# EAGLE design 130609_ReceiverSTM_0_0 (EAGLE 6.1)
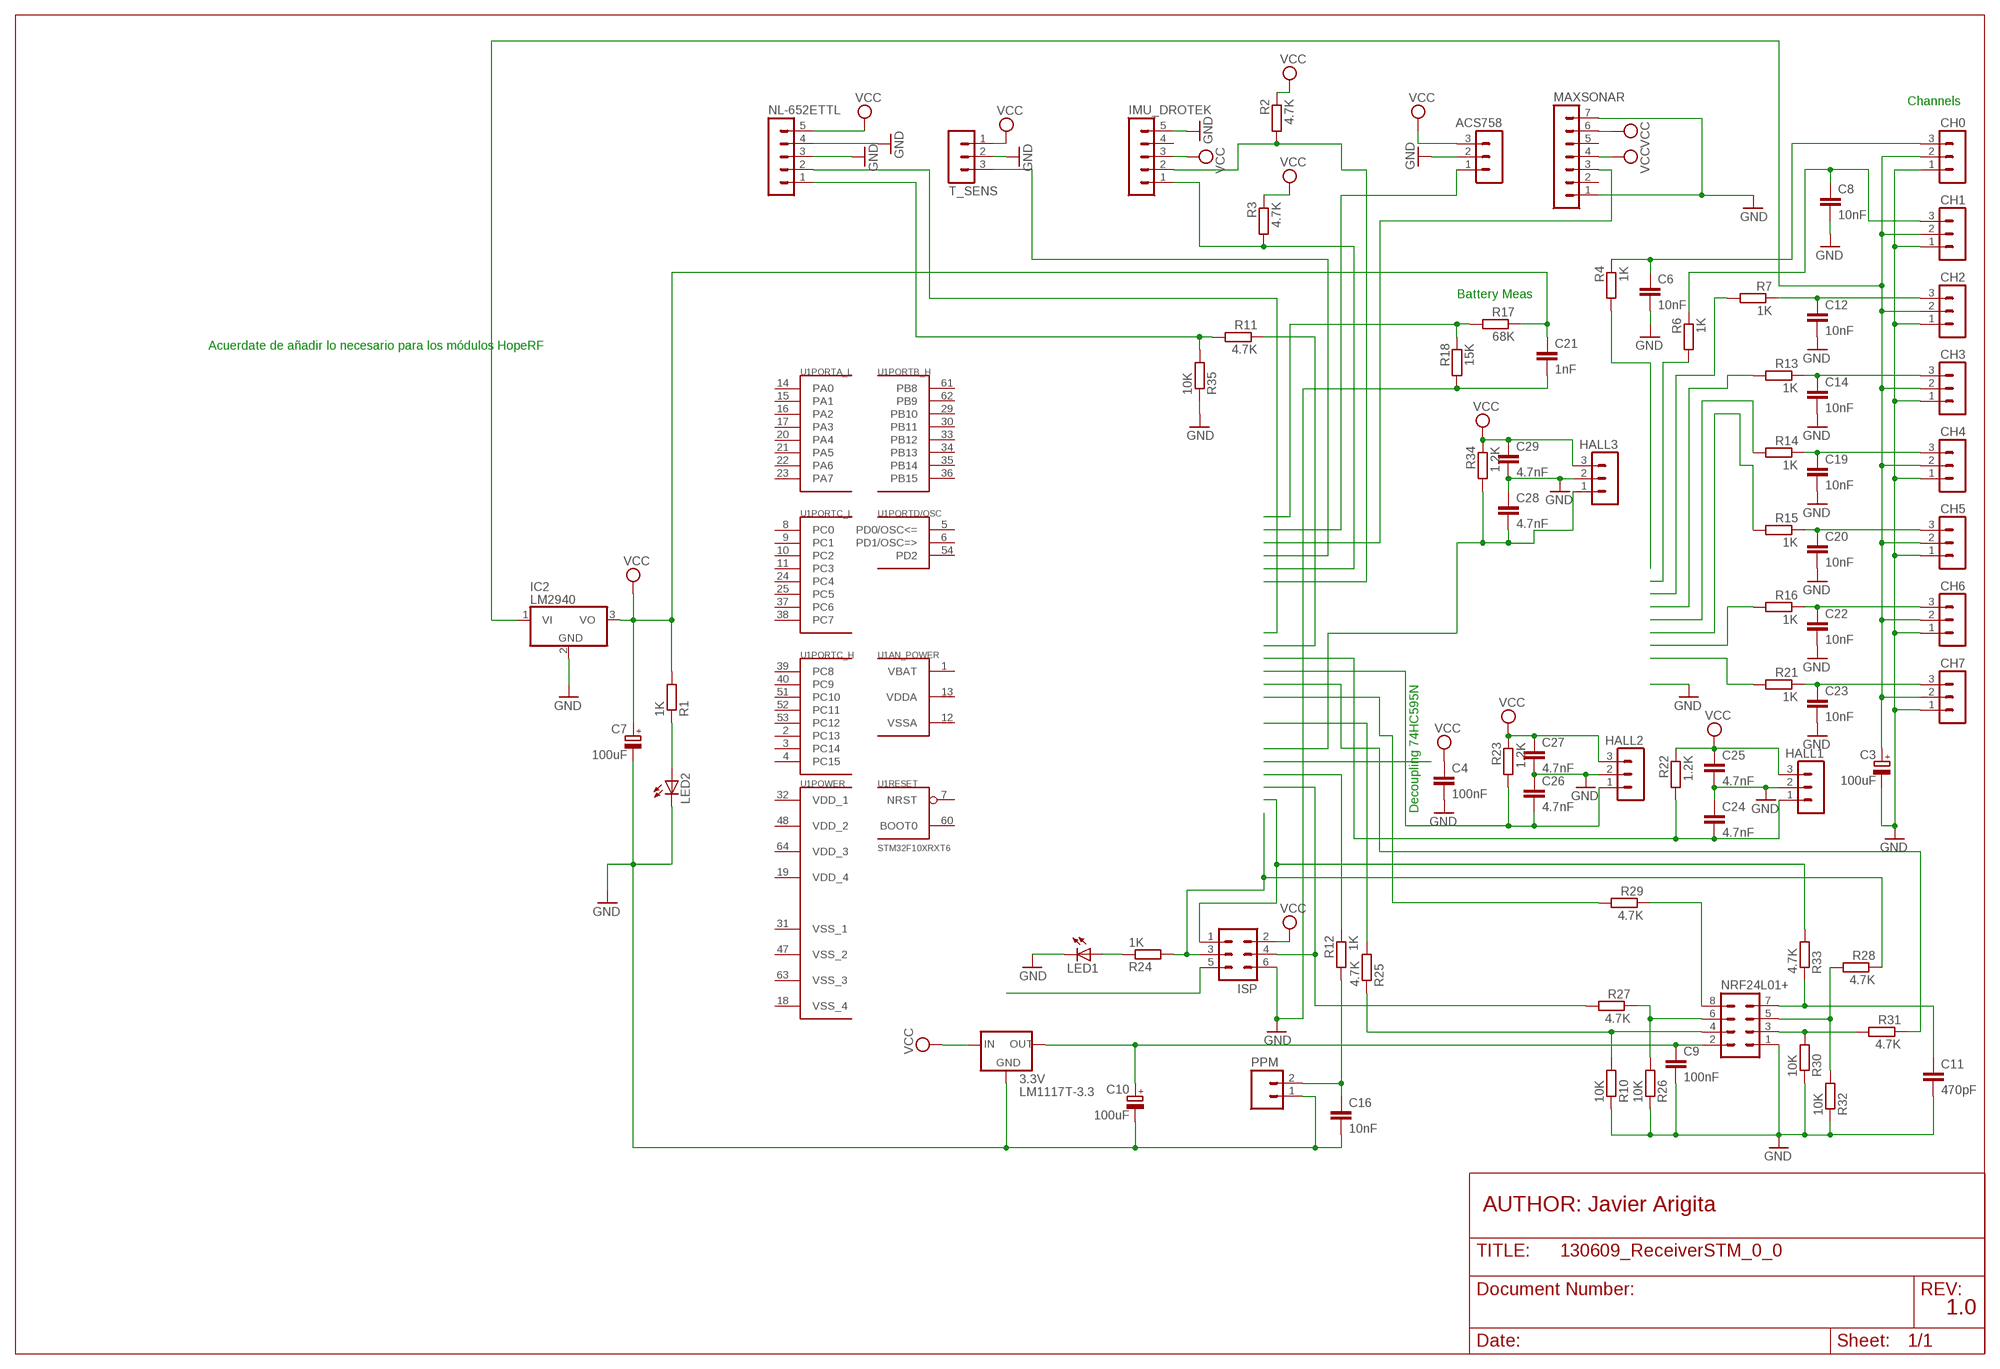
[diagram p0: schematic, sheet 1]

## Parts
3.3V  LM1117T-3.3  [TO220]
ACS758  MA03-1  [MA03-1]
C3  100uF  CPOL-EUE2,5-6E  [E2,5-6E]
C4  100nF  C-EU050-025X075  [C050-025X075]
C6  10nF  C-EU025-030X050  [C025-030X050]
C7  100uF  CPOL-EUE2,5-6E  [E2,5-6E]
C8  10nF  C-EU025-030X050  [C025-030X050]
C9  100nF  C-EU050-025X075  [C050-025X075]
C10  100uF  CPOL-EUE2,5-6E  [E2,5-6E]
C11  470pF  C-EU025-030X050  [C025-030X050]
C12  10nF  C-EU025-030X050  [C025-030X050]
C14  10nF  C-EU025-030X050  [C025-030X050]
C16  10nF  C-EU025-030X050  [C025-030X050]
C19  10nF  C-EU025-030X050  [C025-030X050]
C20  10nF  C-EU025-030X050  [C025-030X050]
C21  1nF  C-EU050-025X075  [C050-025X075]
C22  10nF  C-EU025-030X050  [C025-030X050]
C23  10nF  C-EU025-030X050  [C025-030X050]
C24  4.7nF  C-EU025-030X050  [C025-030X050]
C25  4.7nF  C-EU025-030X050  [C025-030X050]
C26  4.7nF  C-EU025-030X050  [C025-030X050]
C27  4.7nF  C-EU025-030X050  [C025-030X050]
C28  4.7nF  C-EU025-030X050  [C025-030X050]
C29  4.7nF  C-EU025-030X050  [C025-030X050]
CH0  MA03-1  [MA03-1]
CH1  MA03-1  [MA03-1]
CH2  MA03-1  [MA03-1]
CH3  MA03-1  [MA03-1]
CH4  MA03-1  [MA03-1]
CH5  MA03-1  [MA03-1]
CH6  MA03-1  [MA03-1]
CH7  MA03-1  [MA03-1]
HALL1  MA03-1  [MA03-1]
HALL2  MA03-1  [MA03-1]
HALL3  MA03-1  [MA03-1]
IC2  LM2940  [TO220V]
IMU_DROTEK  MA05-1  [MA05-1]
ISP  MA03-2  [MA03-2]
LED1  LED5MM  [LED5MM]
LED2  LED5MM  [LED5MM]
MAXSONAR  MA07-1  [MA07-1]
NL-652ETTL  MA05-1  [MA05-1]
NRF24L01+  MA04-2  [MA04-2]
PPM  M02  [02P]
R1  1K  R-EU_0204/7  [0204/7]
R2  4.7K  R-EU_0204/7  [0204/7]
R3  4.7K  R-EU_0204/7  [0204/7]
R4  1K  R-EU_0204/7  [0204/7]
R6  1K  R-EU_0204/7  [0204/7]
R7  1K  R-EU_0204/7  [0204/7]
R10  10K  R-EU_0204/7  [0204/7]
R11  4.7K  R-EU_0204/7  [0204/7]
R12  1K  R-EU_0204/7  [0204/7]
R13  1K  R-EU_0204/7  [0204/7]
R14  1K  R-EU_0204/7  [0204/7]
R15  1K  R-EU_0204/7  [0204/7]
R16  1K  R-EU_0204/7  [0204/7]
R17  68K  R-EU_0204/7  [0204/7]
R18  15K  R-EU_0204/7  [0204/7]
R21  1K  R-EU_0204/7  [0204/7]
R22  1.2K  R-EU_0204/7  [0204/7]
R23  1.2K  R-EU_0204/7  [0204/7]
R24  1K  R-EU_0204/7  [0204/7]
R25  4.7K  R-EU_0204/7  [0204/7]
R26  10K  R-EU_0204/7  [0204/7]
R27  4.7K  R-EU_0204/7  [0204/7]
R28  4.7K  R-EU_0204/7  [0204/7]
R29  4.7K  R-EU_0204/7  [0204/7]
R30  10K  R-EU_0204/7  [0204/7]
R31  4.7K  R-EU_0204/7  [0204/7]
R32  10K  R-EU_0204/7  [0204/7]
R33  4.7K  R-EU_0204/7  [0204/7]
R34  1.2K  R-EU_0204/7  [0204/7]
R35  10K  R-EU_0204/7  [0204/7]
T_SENS  MA03-1  [MA03-1]
U1  STM32F10XRXT6  [TQFP64]

## Nets
GND: 3.3V.1(GND) ACS758.2 C3.- C4.2 C6.2 C7.- C8.2 C9.2 C10.- C11.2 C12.2 C14.2 C16.2 C19.2 C20.2 C21.2 C22.2 C23.2 C24.1 C25.2 C26.1 C27.2 C28.1 C29.2 CH0.1 CH1.1 CH2.1 CH3.1 CH4.1 CH5.1 CH6.1 CH7.1 HALL1.2 HALL2.2 HALL3.2 IC2.2(GND) IMU_DROTEK.5 ISP.6 LED1.K(C) LED2.K(C) MAXSONAR.1 MAXSONAR.7 NL-652ETTL.3 NL-652ETTL.4 NRF24L01+.1 PPM.1 R10.1 R18.2 R26.1 R30.1 R32.1 R35.1 T_SENS.2
MAX_BRIDGE: NL-652ETTL.2
N$3: ISP.5
N$6: 3.3V.3(IN) ACS758.3 C4.1 C7.+ C21.1 C25.1 C27.1 C29.1 HALL1.3 HALL2.3 HALL3.3 IC2.3(VO) IMU_DROTEK.3 ISP.2 MAXSONAR.4 MAXSONAR.6 NL-652ETTL.5 R1.2 R2.1 R3.1 R17.1 R22.1 R23.1 R34.1 T_SENS.1 ; supply symbol labelled VCC
N$7: LED2.A R1.1
N$8: IMU_DROTEK.2 R2.2
N$11: C28.2 HALL3.1 R34.2
N$12: R11.1
N$14: C24.2 HALL1.1 R22.2
N$15: R12.1
N$17: 3.3V.2(OUT) C9.1 C10.+ NRF24L01+.2
N$18: NRF24L01+.4 R10.2 R25.1
N$19: NRF24L01+.3 R30.2 R31.2
N$20: C16.1 PPM.2 R12.2
N$22: NL-652ETTL.1 R11.2 R35.2
N$25: T_SENS.3
N$26: R25.2
N$27: IMU_DROTEK.1 R3.2
N$28: ACS758.1
N$29: MAXSONAR.3
N$30: C26.2 HALL2.1 R23.2
N$33: R17.2 R18.1
N$35: C3.+ CH0.2 CH1.2 CH2.2 CH3.2 CH4.2 CH5.2 CH6.2 CH7.2 IC2.1(VI)
N$37: ISP.3 R24.2 R28.1
N$38: LED1.A R24.1
N$40: ISP.1 R33.2
N$41: ISP.4 R27.2
N$42: NRF24L01+.8 R29.1
N$43: NRF24L01+.6 R26.2 R27.1
N$46: R31.1
N$47: NRF24L01+.5 R28.2 R32.2
N$49: C11.1 NRF24L01+.7 R33.1
N$50: C6.1 CH0.3 R4.1
N$51: R4.2
N$52: R6.2
N$53: C8.1 CH1.3 R6.1
N$54: C12.1 CH2.3 R7.1
N$55: R7.2
N$56: C14.1 CH3.3 R13.1
N$57: R13.2
N$58: C19.1 CH4.3 R14.1
N$59: R14.2
N$60: C20.1 CH5.3 R15.1
N$61: R15.2
N$62: C22.1 CH6.3 R16.1
N$63: R16.2
N$64: C23.1 CH7.3 R21.1
N$65: R21.2
N$66: R29.2
Unconnected: IMU_DROTEK.4 MAXSONAR.2 MAXSONAR.5 U1.2(PORTC_H:PC13) U1.3(PORTC_H:PC14) U1.4(PORTC_H:PC15) U1.5(PORTD/OSC:PD0/OSC<=) U1.6(PORTD/OSC:PD1/OSC=>) U1.7(RESET:NRST) U1.8(PORTC_L:PC0) U1.9(PORTC_L:PC1) U1.10(PORTC_L:PC2) U1.11(PORTC_L:PC3) U1.14(PORTA_L:PA0) U1.15(PORTA_L:PA1) U1.16(PORTA_L:PA2) U1.17(PORTA_L:PA3) U1.20(PORTA_L:PA4) U1.21(PORTA_L:PA5) U1.22(PORTA_L:PA6) U1.23(PORTA_L:PA7) U1.24(PORTC_L:PC4) U1.25(PORTC_L:PC5) U1.26(PORTB_L:PB0) U1.27(PORTB_L:PB1) U1.28(PORTB_L:PB2) U1.29(PORTB_H:PB10) U1.30(PORTB_H:PB11) U1.33(PORTB_H:PB12) U1.34(PORTB_H:PB13) U1.35(PORTB_H:PB14) U1.36(PORTB_H:PB15) U1.37(PORTC_L:PC6) U1.38(PORTC_L:PC7) U1.39(PORTC_H:PC8) U1.40(PORTC_H:PC9) U1.41(PORTA_H:PA8) U1.42(PORTA_H:PA9) U1.43(PORTA_H:PA10) U1.44(PORTA_H:PA11) U1.45(PORTA_H:PA12) U1.46(PORTA_H:PA13) U1.49(PORTA_H:PA14) U1.50(PORTA_H:PA15) U1.51(PORTC_H:PC10) U1.52(PORTC_H:PC11) U1.53(PORTC_H:PC12) U1.54(PORTD/OSC:PD2) U1.55(PORTB_L:PB3) U1.56(PORTB_L:PB4) U1.57(PORTB_L:PB5) U1.58(PORTB_L:PB6) U1.59(PORTB_L:PB7) U1.60(RESET:BOOT0) U1.61(PORTB_H:PB8) U1.62(PORTB_H:PB9)

## Notes on the sheet
- Channels
- Battery Meas
- Acuerdate de añadir lo necesario para los módulos HopeRF
- Decoupling 74HC595N
- AUTHOR: Javier Arigita
- 1.0

## Power pins joined to a net without a drawn wire
VBAT: U1.1(AN_POWER:VBAT)
VDD_1: U1.32(POWER:VDD_1)
VDD_2: U1.48(POWER:VDD_2)
VDD_3: U1.64(POWER:VDD_3)
VDD_4: U1.19(POWER:VDD_4)
VDDA: U1.13(AN_POWER:VDDA)
VSS_1: U1.31(POWER:VSS_1)
VSS_2: U1.47(POWER:VSS_2)
VSS_3: U1.63(POWER:VSS_3)
VSS_4: U1.18(POWER:VSS_4)
VSSA: U1.12(AN_POWER:VSSA)

## Library data of the parts
3.3V = lm1117:LM1117T-*
ACS758 CH0 CH1-CH7 HALL1-HALL3 T_SENS = con-lstb:MA03-1: PIN HEADER; OC_FARNELL: unknown; OC_NEWARK: unknown
C3 C7 C10 = rcl:CPOL-EU: POLARIZED CAPACITOR, European symbol
C4 C6 C8 C9 C11 C12 C14 C16 C19-C29 = rcl:C-EU: CAPACITOR, European symbol
IC2 = lm2940:LM2940: LM2940-5 1A Voltage Regulators
IMU_DROTEK NL-652ETTL = con-lstb:MA05-1: PIN HEADER; OC_FARNELL: unknown; OC_NEWARK: unknown
ISP = con-lstb:MA03-2: PIN HEADER; OC_FARNELL: unknown; OC_NEWARK: unknown
LED1 LED2 = led:LED: LED OSRAM: - CHIPLED LG R971, LG N971, LY N971, LG Q971, LY Q971, LO R971, LY R971 LH N974, LH R974 LS Q976, LO Q976, LY Q976 LO Q996 - Hyper CHIPLED LW Q18S LB Q993, LB Q99A, LB R99A - SideLED LS A670, LO A670, LY A670, LG A670, LP A670 LB A673, LV A673, LT A673, LW A673 LH A674 LY A675 LS A676, LA A676, LO A676, LY A676, LW A676 LS A679, LY A679, LG A679 - Hyper Micro SIDELED® LS Y876, LA Y876, LO Y876, LY Y876 LT Y87S - SmartLED LW L88C, LW L88S LB L89C, LB L89S, LG L890 LS L89K, LO L89K, LY L89K LS L896, LA L896, LO L896, LY L896 - TOPLED LS T670, LO T670, LY T670, LG T670, LP T670 LSG T670, LSP T670, LSY T670, LOP T670, LYG T670 LG T671, LOG T671, LSG T671 LB T673, LV T673, LT T673, LW T673 LH T674 LS T676, LA T676, LO T676, LY T676, LB T676, LH T676, LSB T676, LW T676 LB T67C, LV T67C, LT T67C, LS T67K, LO T67K, LY T67K, LW E67C LS E67B, LA E67B, LO E67B, LY E67B, LB E67C, LV E67C, LT E67C LW T67C LS T679, LY T679, LG T679 LS T770, LO T770, LY T770, LG T770, LP T770 LB T773, LV T773, LT T773, LW T773 LH T774 LS E675, LA E675, LY E675, LS T675 LS T776, LA T776, LO T776, LY T776, LB T776 LHGB T686 LT T68C, LB T68C - Hyper Mini TOPLED® LB M676 - Mini TOPLED Santana® LG M470 LS M47K, LO M47K, LY M47K Source: http://www.osram.convergy.de LUXEON: - LUMILED® LXK2-PW12-R00, LXK2-PW12-S00, LXK2-PW14-U00, LXK2-PW14-V00 LXK2-PM12-R00, LXK2-PM12-S00, LXK2-PM14-U00 LXK2-PE12-Q00, LXK2-PE12-R00, LXK2-PE12-S00, LXK2-PE14-T00, LXK2-PE14-U00 LXK2-PB12-K00, LXK2-PB12-L00, LXK2-PB12-M00, LXK2-PB14-N00, LXK2-PB14-P00, LXK2-PB14-Q00 LXK2-PR12-L00, LXK2-PR12-M00, LXK2-PR14-Q00, LXK2-PR14-R00 LXK2-PD12-Q00, LXK2-PD12-R00, LXK2-PD12-S00 LXK2-PH12-R00, LXK2-PH12-S00 LXK2-PL12-P00, LXK2-PL12-Q00, LXK2-PL12-R00 Source: www.luxeon.com KINGBRIGHT: KA-3528ASYC Source: www.kingbright.com
MAXSONAR = con-lstb:MA07-1: PIN HEADER; OC_FARNELL: unknown; OC_NEWARK: unknown
NRF24L01+ = con-lstb:MA04-2: PIN HEADER; OC_FARNELL: unknown; OC_NEWARK: unknown
PPM = con-amp-quick:M02: AMP QUICK CONNECTOR; OC_FARNELL: unknown; OC_NEWARK: unknown
R1-R4 R6 R7 R10-R18 R21-R35 = rcl:R-EU_: RESISTOR, European symbol
U1 = stm32:STM32F10XRXT6: STM32F101/103 64pin LQFP

## Board
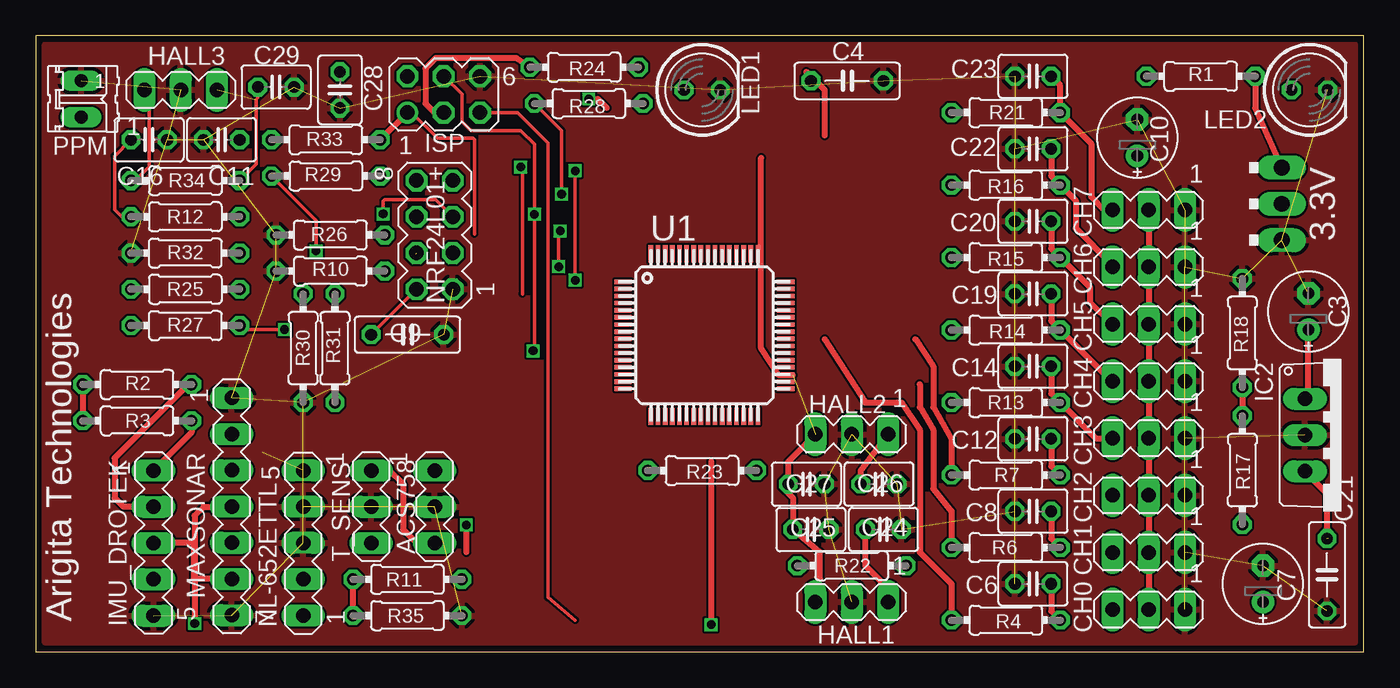
[diagram p1: board, top side]
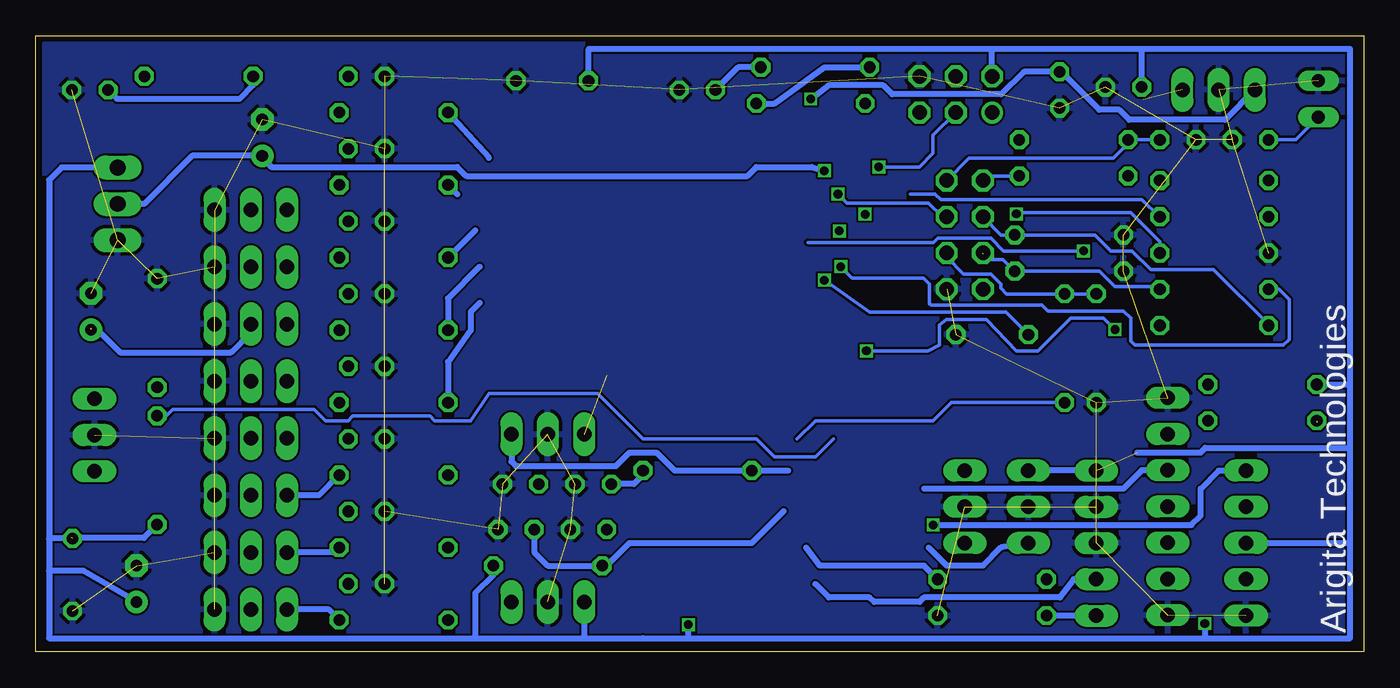
[diagram p2: board, bottom side, seen from below]

Size 93.02 x 43.17 mm. Coordinates in mm from the lower left corner, seen from the top.
Outline: 0,0 93.02,0 93.02,43.17 0,43.17 0,0
Copper layers (1*16): Top 0.035mm / dielectric 1.5mm / Bottom 0.035mm
Design rules: minimum track width 6mil, minimum drill 12mil, track to track 6mil, track to pad 6mil, pad to pad 6mil, via to via 6mil, smd to smd 0mil, copper to edge 10mil, drill to drill 10mil, minimum pad ring 10mil, minimum via ring 6mil, stop-mask expansion 2mil, vias tented up to drill 100mil, thermal gap 10mil

### Footprints (pad centres in the part's own frame; a part is rotated, then mirrored left to right if it is on the bottom)
TO220 = drill 1.118 long: 1 -2.54,-6.35; 2 0,-6.35; 3 2.54,-6.35
MA03-1 = drill 1.016 long: 1 -2.54,0; 2 0,0; 3 2.54,0
E2,5-6E = drill 0.813 pad 1.575: + -1.27,0 | drill 0.813 pad 1.575 octagon: - 1.27,0
C050-025X075 = drill 0.813 octagon: 1 -2.54,0; 2 2.54,0
C025-030X050 = drill 0.813 octagon: 1 -1.27,0; 2 1.27,0
TO220V = drill 1.016 long: 1 -2.54,-2.54; 2 0,-2.54; 3 2.54,-2.54
MA05-1 = drill 1.016 long: 1 -5.08,0; 2 -2.54,0; 3 0,0; 4 2.54,0; 5 5.08,0
MA03-2 = drill 1.016: 1 -2.54,-1.27 | drill 1.016 octagon: 2 -2.54,1.27; 3 0,-1.27; 4 0,1.27; 5 2.54,-1.27; 6 2.54,1.27
LED5MM = drill 0.813 octagon: A -1.27,0; K 1.27,0
MA07-1 = drill 1.016 long: 1 -7.62,0; 2 -5.08,0; 3 -2.54,0; 4 0,0; 5 2.54,0; 6 5.08,0; 7 7.62,0
MA04-2 = drill 1.016 octagon: 1 -3.81,-1.27; 2 -3.81,1.27; 3 -1.27,-1.27; 4 -1.27,1.27; 5 1.27,-1.27; 6 1.27,1.27; 7 3.81,-1.27; 8 3.81,1.27
02P = drill 0.914 long: 1 -1.27,0; 2 1.27,0
0204/7 = drill 0.813 octagon: 1 -3.81,0; 2 3.81,0
TQFP64 = smd 1.2 x 0.3: 1 -5.7,3.75; 2 -5.7,3.25; 3 -5.7,2.75; 4 -5.7,2.25; 5 -5.7,1.75; 6 -5.7,1.25; 7 -5.7,0.75; 8 -5.7,0.25; 9 -5.7,-0.25; 10 -5.7,-0.75; 11 -5.7,-1.25; 12 -5.7,-1.75; 13 -5.7,-2.25; 14 -5.7,-2.75; 15 -5.7,-3.25; 16 -5.7,-3.75; 33 5.7,-3.75; 34 5.7,-3.25; 35 5.7,-2.75; 36 5.7,-2.25; 37 5.7,-1.75; 38 5.7,-1.25; 39 5.7,-0.75; 40 5.7,-0.25; 41 5.7,0.25; 42 5.7,0.75; 43 5.7,1.25; 44 5.7,1.75; 45 5.7,2.25; 46 5.7,2.75; 47 5.7,3.25; 48 5.7,3.75 | smd 0.3 x 1.2: 17 -3.75,-5.7; 18 -3.25,-5.7; 19 -2.75,-5.7; 20 -2.25,-5.7; 21 -1.75,-5.7; 22 -1.25,-5.7; 23 -0.75,-5.7; 24 -0.25,-5.7; 25 0.25,-5.7; 26 0.75,-5.7; 27 1.25,-5.7; 28 1.75,-5.7; 29 2.25,-5.7; 30 2.75,-5.7; 31 3.25,-5.7; 32 3.75,-5.7; 49 3.75,5.7; 50 3.25,5.7; 51 2.75,5.7; 52 2.25,5.7; 53 1.75,5.7; 54 1.25,5.7; 55 0.75,5.7; 56 0.25,5.7; 57 -0.25,5.7; 58 -0.75,5.7; 59 -1.25,5.7; 60 -1.75,5.7; 61 -2.25,5.7; 62 -2.75,5.7; 63 -3.25,5.7; 64 -3.75,5.7

### Placement (x,y rotation side)
3.3V  80.93,31.39 90 top
ACS758  27.94,10.16 270 top
C3  89.13,23.85 90 top
C4  56.83,40 0 top
C6  69.85,4.76 180 top
C7  85.95,4.76 90 top
C8  69.85,9.84 180 top
C9  26.04,22.23 0 top
C10  77.15,36.02 90 top
C11  13.02,35.88 180 top
C12  69.85,14.92 180 top
C14  69.85,20 180 top
C16  7.94,35.88 0 top
C19  69.85,25.08 180 top
C20  69.85,30.16 180 top
C21  90.44,5.4 270 top
C22  69.85,35.24 180 top
C23  69.85,40.32 180 top
C24  59.37,8.57 180 top
C25  54.29,8.57 0 top
C26  59.05,11.75 180 top
C27  53.97,11.75 0 top
C28  21.31,39.37 90 top
C29  16.83,39.57 0 top
CH0  77.95,2.96 180 top
CH1  77.95,6.96 180 top
CH2  77.95,10.96 180 top
CH3  77.95,14.96 180 top
CH4  77.95,18.96 180 top
CH5  77.95,22.96 180 top
CH6  77.95,26.96 180 top
CH7  77.95,30.96 180 top
HALL1  57.15,3.49 180 top
HALL2  57.15,15.24 180 top
HALL3  10.16,39.37 0 top
IC2  91.43,15.18 270 top
IMU_DROTEK  8.25,7.62 270 top
ISP  28.57,39.05 0 top
LED1  46.67,39.37 0 top
LED2  89.22,39.37 0 top
MAXSONAR  13.73,10.18 270 top
NL-652ETTL  18.73,7.62 90 top
NRF24L01+  27.94,29.21 90 top
PPM  3.17,38.73 270 top
R1  81.6,40.32 0 top
R2  7.1,18.73 0 top
R3  7.1,16.19 0 top
R4  67.94,2.22 180 top
R6  67.94,7.3 180 top
R7  67.94,12.38 180 top
R10  20.64,26.67 0 top
R11  26.04,5.08 180 top
R12  10.48,30.48 180 top
R13  67.94,17.46 180 top
R14  67.94,22.54 180 top
R15  67.94,27.62 180 top
R16  67.94,32.7 180 top
R17  84.51,12.73 90 top
R18  84.51,22.34 90 top
R21  67.94,37.78 180 top
R22  57.15,6.03 180 top
R23  46.67,12.7 180 top
R24  38.42,40.96 180 top
R25  10.48,25.4 180 top
R26  20.64,29.21 0 top
R27  10.48,22.86 0 top
R28  38.73,38.42 180 top
R29  20.32,33.34 180 top
R30  18.73,21.27 90 top
R31  20.95,21.27 90 top
R32  10.48,27.94 0 top
R33  20.32,35.88 0 top
R34  10.48,33.02 180 top
R35  26.04,2.54 180 top
T_SENS  23.5,10.16 270 top
U1  46.83,22.18 0 top

### Tracks (layer width: path | path; a pad name or v marks a point on that pad's centre or on a via)
GND  (52 unrouted)
  pour Top: 0.63,42.54 92.39,42.54 92.39,0.64 0.63,0.64
  pour Bottom: 0.63,42.54 92.39,42.54 92.39,0.64 0.63,0.64
MAX_BRIDGE
  Bottom 0.406: NL-652ETTL.2 20.32,5.08 21.27,3.81 30.8,3.81 31.11,3.49 34.29,3.49 34.61,3.81 37.47,3.81 38.42,4.76
N$3
  Top 0.254: 37.78,2.22 35.88,3.81 35.88,35.65 33.75,37.78 ISP.5
N$6  (via drill 0.6)  (5 unrouted)
  Top 0.254: R34.1 15.43,34.17 15.43,38.68 15.56,38.81 C29.1
  Top 0.406: 53.02,19.37 52.07,19.37 50.8,21.27 50.8,34.61 | C4.1 53.97,40.64 55.25,39.37 55.25,36.2 | R1.2 85.41,38.1 3.3V.3 | HALL1.3 54.61,4.76 54.93,5.08 54.93,6.99 C25.1 53.02,10.8 52.71,11.11 C27.1 52.71,13.33 HALL2.3 | T_SENS.1 24.77,12.7 25.72,11.75 25.72,8.57 26.67,7.62 ACS758.3 | 47.31,13.33 v47.31,1.91 | MAXSONAR.4 13.73,10.16 11.75,10.16 11.11,9.52 11.13,9.52 v11.13,1.98 | MAXSONAR.6 11.11,5.1 11.11,7.62 IMU_DROTEK.3 | R2.1 3.29,16.08 3.33,16.08 | IC2.3 90.44,11.1 C21.1
  Bottom 0.406: 92.08,7.94 92.08,5.68 | 92.08,5.68 92.08,0.95 62.23,0.95 | 62.23,0.95 54.61,0.95 | 54.61,0.95 50.48,0.95 47.31,0.95 | 47.31,0.95 11.13,0.95 | 11.13,0.95 0.95,0.95 0.95,7.62 | 0.95,7.62 0.95,14.29 | 0.95,14.29 0.95,18.68 | 0.95,18.68 0.95,42.23 15.56,42.23 | 15.56,42.23 26.04,42.23 | 26.04,42.23 54.29,42.23 C4.1 | 3.3V.3 91.21,33.92 92.08,33.06 92.08,7.94 | C7.+ 89.68,5.68 92.08,5.68 | C21.1 92.08,7.94 | 0.95,14.29 11.11,14.29 11.43,13.97 15.88,13.97 | HALL1.3 54.61,0.95 | R22.1 60.96,5.4 62.23,4.13 62.23,0.95 | R23.1 50.48,12.38 51.12,11.75 C27.1 | 47.31,0.95 v47.31,1.91 | NL-652ETTL.5 T_SENS.1 | IMU_DROTEK.3 0.95,7.62 | C29.1 15.56,42.23 | ISP.2 26.04,42.23 | R2.1 1,18.73 0.95,18.68 | v11.13,1.98 11.13,0.95 | R17.1 85.44,7.98 90.53,7.98
N$7
  Bottom 0.406: R1.1 77.79,39.69 78.74,38.74 87.31,38.74 LED2.A
N$8
  Top 0.406: R2.2 10.68,18.73 5.53,13.58 5.53,10.78 6.13,10.18 8.23,10.18 IMU_DROTEK.2
N$11  (via drill 0.6)
  Top 0.254: HALL3.1 7.93,39.06 7.93,33.98 6.97,33.02 R34.2
  Top 0.406: v38.74,38.74 39.37,38.74 40,38.1
  Bottom 0.406: v38.74,38.74 37.47,39.69 33.65,39.69 33.02,39.05 25.4,39.05 23.81,40.64 C28.2 21.19,40.64 18.53,37.98 17.13,37.98 16.43,37.28 9.71,37.28 HALL3.1
N$12
  Bottom 0.406: R11.1 30.8,6.03 38.1,6.03 39.05,7.3
N$14
  Top 0.406: HALL1.1 59.69,4.45 58.1,6.03 C24.2
  Bottom 0.406: C24.2 58.1,6.99 57.15,6.03 R22.2 53.02,6.03 51.43,7.62 42.86,7.62 40.64,9.84
N$15
  Bottom 0.254: 31.76,32.08 30.03,32.08 29.63,31.68 15.53,31.68 14.33,30.48 R12.1
N$17  (via drill 0.6)
  Top 0.254: NRF24L01+.2 C9.1 | v37.78,33.71 v37.78,26.03
  Bottom 0.254: v37.78,26.03 34.61,23.81 25.08,23.81 C9.1
  Bottom 0.406: v37.78,33.71 38.68,33.97 42.54,33.97 43.18,33.34 62.86,33.34 63.5,33.97 76.52,33.97 C10.+ 82.06,34.75 85.43,31.38 3.3V.2
N$18  (1 unrouted)
  Bottom 0.254: 26.63,27.88 26.43,27.88 26.03,27.48 25.26,27.48 R10.2 18.52,26.67 17.43,25.58 14.47,25.58 R25.1
N$19
  Bottom 0.254: R30.2 R31.2 25.03,25.08 25.43,25.48 25.43,25.78 26.13,26.48 28.03,26.48 29.21,27.66 NRF24L01+.3
N$20
  Top 0.254: C16.1 5.53,34.74 5.53,30.98 6.04,30.48 R12.2
  Bottom 0.254: PPM.2 4.76,35.88 C16.1
N$22
  Top 0.406: R35.2 R11.2
  Bottom 0.406: NL-652ETTL.1 R35.2
N$25
  Bottom 0.406: T_SENS.3 25.4,7.3 26.67,6.03 29.21,6.03 30.48,7.3
N$26  (via drill 0.6)
  Top 0.254: v36.73,29.48 36.63,29.38 v36.63,26.98
  Bottom 0.254: 36.79,29.48 v36.73,29.48 | v36.63,26.98 35.83,26.18 30.83,26.18 30.43,25.78 30.43,24.38 30.33,24.28 22.53,24.28 22.13,23.88 16.83,23.88 16.33,23.38 16.33,21.78 16.03,21.48 5.63,21.48 5.23,21.88 5.23,24.68 5.95,25.4 R25.2
N$27  (via drill 0.6)
  Top 0.406: 30.16,6.99 v30.16,8.89 | R3.2 10.91,15.36 IMU_DROTEK.1
  Bottom 0.406: v30.16,8.89 12.07,8.89 11.43,9.52 11.43,11.43 10.16,12.7 IMU_DROTEK.1
N$29
  Bottom 0.406: 30.8,11.43 16.83,11.43 15.56,12.7 15.56,12.72 MAXSONAR.3
N$30
  Top 0.406: C26.2 57.79,12.7 HALL2.1
  Bottom 0.406: HALL2.1 59.69,13.33 59.37,13.02 52.39,13.02 51.43,13.97 49.53,13.97 48.26,12.7 R23.2 40.32,12.7
N$33
  Top 0.406: R18.1 R17.2
  Bottom 0.254: 37.15,14.92 38.42,13.65 41.28,13.65 42.54,14.92 50.48,14.92 53.66,18.1 61.28,18.1 62.55,16.19 65.09,16.19 65.41,16.51 70.8,16.51 71.12,16.19 72.71,16.19 73.5,16.98 83.43,16.98 83.88,16.54 R17.2
N$35  (1 unrouted)
  Top 0.406: CH7.2 CH6.2 CH5.2 CH4.2 CH3.2 CH2.2 CH1.2 CH0.2 | IC2.1 89.13,17.72 89.13,22.68
  Bottom 0.406: CH5.2 77.95,22.37 79.33,20.98 87.11,20.98 88.71,22.58 C3.+
N$37  (via drill 0.6)
  Top 0.254: v33.97,33.97 34.09,33.65 34.09,25.08
  Top 0.406: R24.2 33.65,41.59 28.01,41.59 27.3,40.88 27.3,38.42 27.94,37.78 ISP.3
  Bottom 0.254: ISP.3 30.16,36.2 30.16,34.92 31.11,33.97 v33.97,33.97
  Bottom 0.406: R28.1 41.28,38.42 37.78,40.96 R24.2
N$38
  Bottom 0.406: R24.1 43.82,40.96 LED1.A
N$40
  Top 0.254: 30.73,29.28 30.73,35.88 30.63,35.98 28.13,35.98 26.33,37.78 ISP.1
  Top 0.406: ISP.1 R33.2
N$41  (via drill 0.6)
  Top 0.254: ISP.4 29.85,39.05 29.85,37.15 30.48,36.51 33.97,36.51 34.93,35.56 v34.93,30.66 34.93,21.17 v34.83,21.08 | R27.2 14.57,22.58 v17.43,22.58
  Bottom 0.254: v17.43,22.58 18.23,23.38 20.53,23.38 22.83,21.08 24.33,21.08 26.43,23.28 29.23,23.28 29.73,22.88 29.73,21.48 30.53,21.08 v34.83,21.08
N$42
  Bottom 0.254: NRF24L01+.8 26.35,33.34 R29.1
N$43
  Bottom 0.254: NRF24L01+.6 25.4,29.21 R26.2 24.42,29.18 18.83,29.18 17.73,28.08 16.23,28.08 14.93,26.78 10.53,26.78 6.67,22.92 R27.1
N$46
  Bottom 0.254: R31.1 28.89,17.46 30.16,16.19 38.42,16.19 39.69,14.92
N$47  (via drill 0.6)
  Top 0.254: R28.2 36.83,36.51 v36.83,32.07 | NRF24L01+.5 28.01,31.68 24.43,31.68 24.33,31.58 v24.33,30.68
  Bottom 0.254: 29.53,30.48 30.48,31.43 36.19,31.43 v36.83,32.07 | v24.33,30.68 24.23,30.78 16.33,30.78 14.29,28.74 R32.2
  Bottom 0.406: 29.53,30.48 NRF24L01+.5
N$49
  Bottom 0.254: NRF24L01+.7 27.65,34.58 17.53,34.58 16.51,35.6 R33.1 C11.1
N$50
  Top 0.406: C6.1 71.12,2.86 R4.1
  Bottom 0.406: R4.1 72.49,2.96 CH0.3
N$51
  Top 0.406: 55.25,21.91 58.1,17.46 60.64,17.46 61.91,15.56 61.91,6.99 64.13,4.76 R4.2
N$52
  Top 0.406: 61.91,18.73 61.91,17.14 62.86,15.56 62.86,11.43 64.13,9.84 R6.2
N$53
  Top 0.406: C8.1 71.12,7.94 R6.1
  Bottom 0.406: R6.1 72.1,6.96 CH1.3
N$54
  Top 0.406: C12.1 71.12,13.02 R7.1
  Bottom 0.406: R7.1 73.18,10.96 CH2.3
N$55
  Top 0.406: 61.6,21.91 62.86,20 62.86,17.14 64.13,14.92 R7.2
N$56
  Top 0.406: C14.1 71.12,18.1 R13.1 74.25,14.96 CH3.3
N$57
  Bottom 0.406: 61.91,24.45 62.55,23.81 62.55,22.54 64.13,20.32 R13.2
N$58
  Top 0.406: C19.1 71.12,23.18 R14.1 75.33,18.96 CH4.3
N$59
  Bottom 0.406: 61.91,26.99 64.13,24.76 R14.2
N$60
  Top 0.406: C20.1 71.12,28.26 R15.1 73.83,25.55 73.83,24.48 75.35,22.96 CH5.3
N$61
  Bottom 0.406: 62.23,29.53 R15.2
N$62
  Top 0.406: C22.1 71.12,33.34 R16.1 72.83,31.62 72.83,29.68 75.41,27.11 CH6.3
N$63
  Bottom 0.406: 63.5,32.07 R16.2
N$64
  Top 0.406: C23.1 71.75,39.69 R21.1 73.93,35.6 73.93,31.88 74.85,30.96 CH7.3
N$65
  Bottom 0.406: 61.28,34.61 R21.2
N$66  (via drill 0.6)
  Top 0.254: R29.2 19.63,30.21 v19.63,28.08
  Bottom 0.254: 38.94,28.68 30.13,28.68 29.83,28.98 26.13,28.98 25.23,28.08 v19.63,28.08 19.53,28.08

### Text on the board
tPlace: Arigita Technologies
bPlace: Arigita Technologies